# EAGLE board electron_v020 (EAGLE 7.2.0)
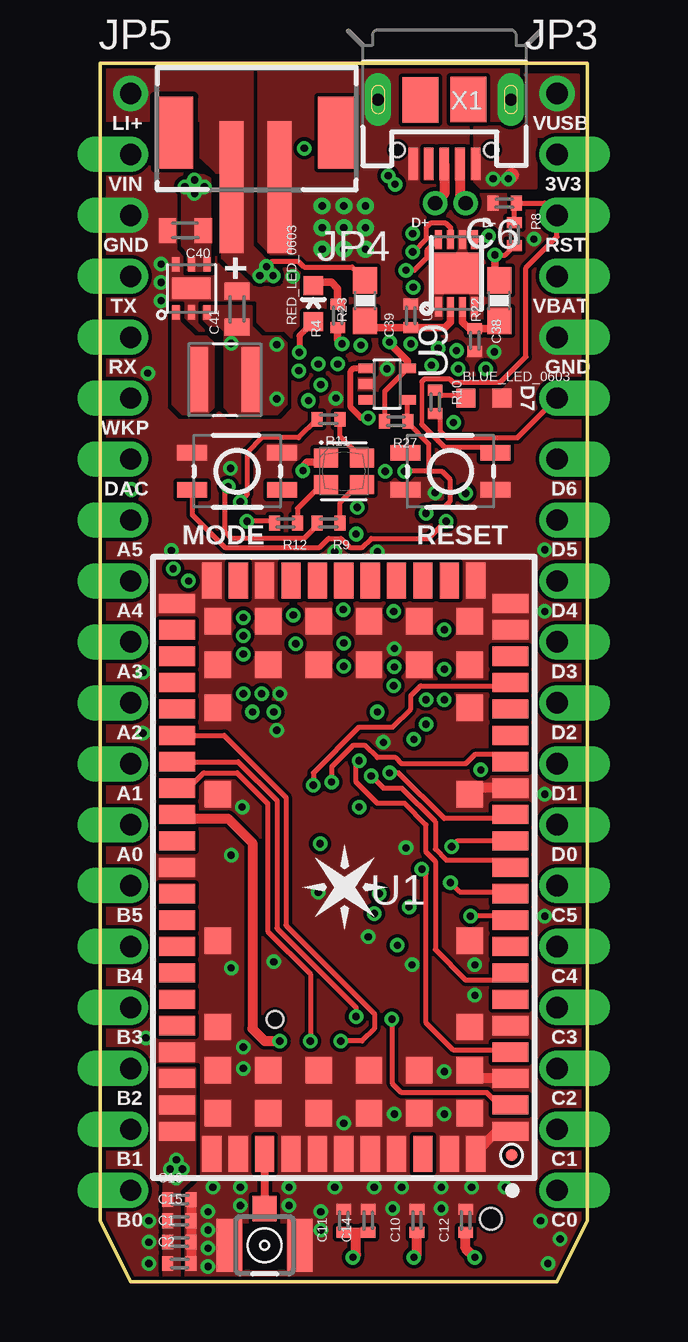
[diagram p4: board, top side]
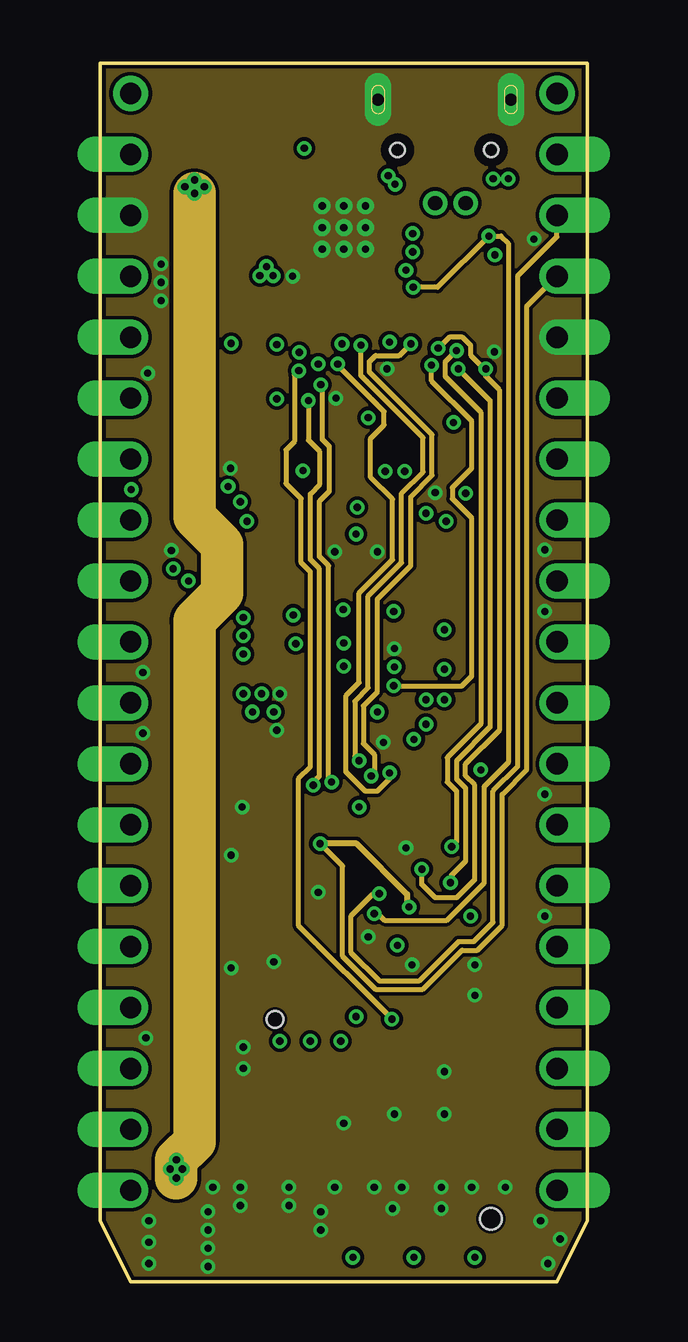
[diagram p5: board, inner layer $GND]
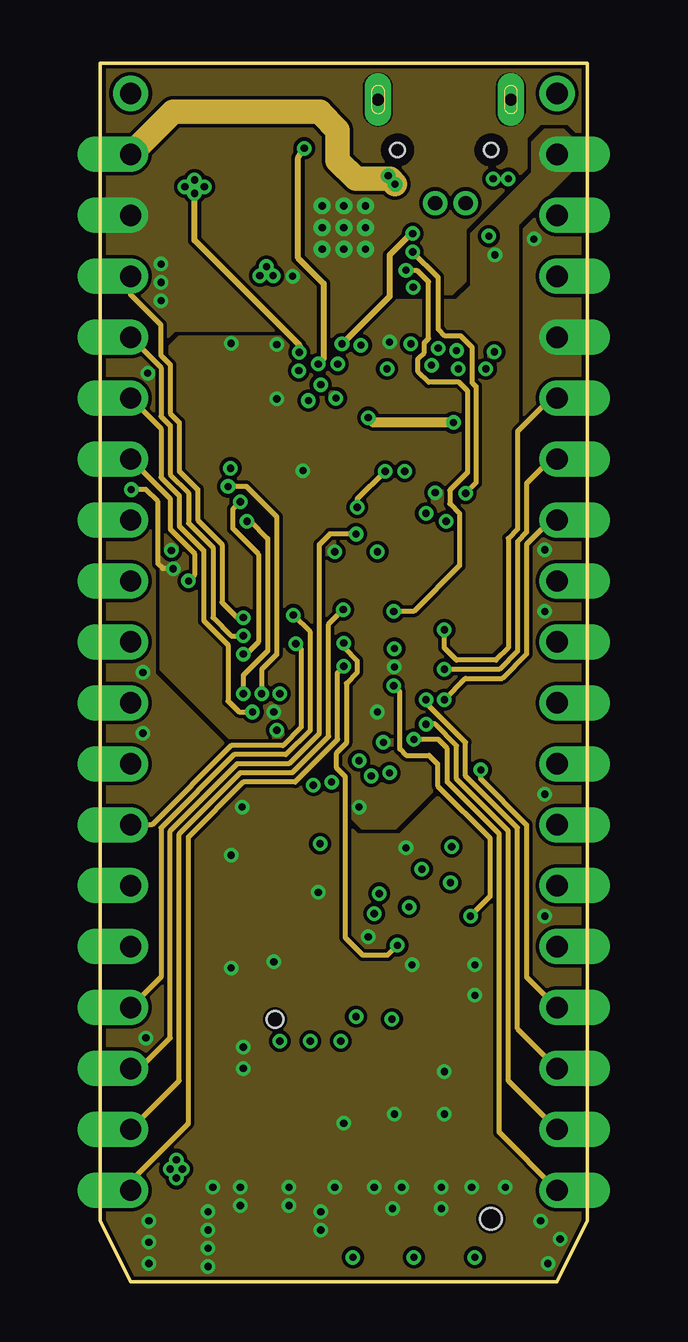
[diagram p6: board, inner layer $+3V3]
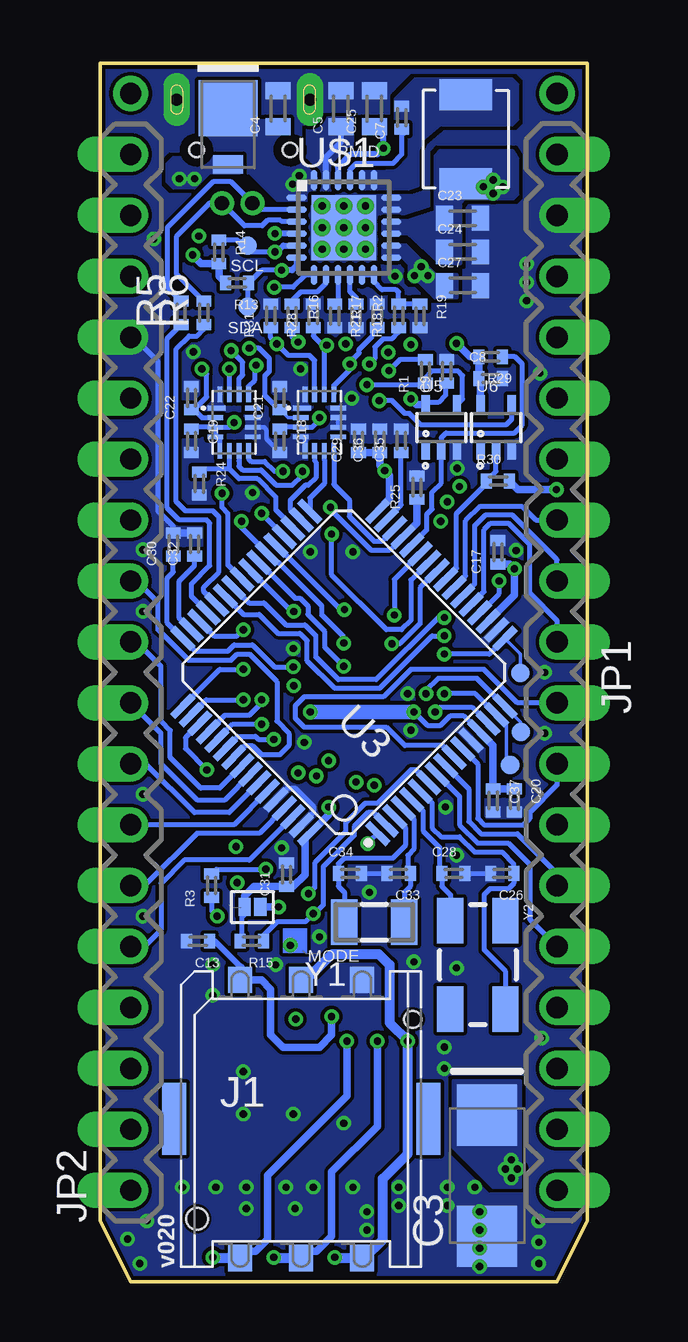
[diagram p7: board, bottom side, seen from below]

Size 20.32 x 50.8 mm. Coordinates in mm from the lower left corner, seen from the top.
Outline: 0,50.8 0,2.54 1.27,0 19.05,0 20.32,2.54 20.32,50.8 0,50.8
Copper layers (1+2*15+16): Top 0.018mm / dielectric 0.195mm / $GND 0.035mm / dielectric 1.1mm / $+3V3 0.035mm / dielectric 0.195mm / Bottom 0.018mm
Design rules "particle-4layer": minimum track width 6mil, minimum drill 0.3mm, track to track 6mil, track to pad 6mil, pad to pad 6mil, via to via 6mil, smd to smd 6mil, copper to edge 6mil, drill to drill 6mil, minimum pad ring 8mil, minimum via ring 6mil, stop-mask expansion 4mil, vias tented up to drill 20mil, thermal gap 8mil
Net classes: 2 RF: width 0.33 mm, clearance 0.191 mm; 3 BAT: clearance 0.203 mm

## Footprints (pad centres in the part's own frame; a part is rotated, then mirrored left to right if it is on the bottom)
LED-0603-NS = smd 0.8 x 0.8: A -0.75,0; C 0.75,0
C0402_B = smd 0.457 x 0.61: 1 -0.483,0; 2 0.483,0
C/6032-28R = smd 2.55 x 2.5: + 2.525,0; - -2.525,0
C0603_B = smd 0.711 x 1.041: 1 -0.749,0; 2 0.749,0
GCT-SIM8100 = smd 1 x 1.1: C1 2.54,-5.8; C2 0,-5.8; C3 -2.54,-5.8; C5 2.54,5.8; C6 0,5.8; C7 -2.54,5.8 | smd 1 x 3: NC@1 -5.3,0; NC@2 5.3,0 | hole 0.7: 4.65,4.15 | hole 0.9: -4.35,-4.15
IPEX-20279-001E = smd 1 x 1.05: 1 0,1.528 | smd 1.05 x 2.2: 2@1 -1.475,0; 2@2 1.475,0
JUMPER_SMD_NC = smd 0.508 x 0.762: 1 -0.33,0; 2 0.33,0
1X18-D-PADS = drill 0.889 pad 1.473 offset: 1 -21.59,0; 2 -19.05,0; 3 -16.51,0; 4 -13.97,0; 5 -11.43,0; 6 -8.89,0; 7 -6.35,0; 8 -3.81,0; 9 -1.27,0; 10 1.27,0; 11 3.81,0; 12 6.35,0; 13 8.89,0; 14 11.43,0; 15 13.97,0; 16 16.51,0; 17 19.05,0; 18 21.59,0
1X01_NO_SILK = drill 0.889 pad 1.473: 1 0,0
JST-2-SMD-VERT = smd 1 x 5.5: GND 1,-2; VCC -1,-2 | smd 1.6 x 3: P$1 -3.4,0.27; P$2 3.4,0.27
PLCC4-2MM-RGB = smd 1 x 0.8: BLUE -0.75,-0.55; CA 0.75,-0.55; GREEN -0.75,0.55; RED 0.75,0.55
R0402_B = smd 0.457 x 0.61: 1 -0.483,0; 2 0.483,0
0603-RES = smd 1.1 x 1: 1 -0.85,0; 2 0.85,0
LED-0603 = smd 0.8 x 0.8: A 0,-0.75; C 0,0.75
TACTILE_SWITCH_SMD = smd 1.25 x 0.65: 1 -1.875,0.775; 2 1.875,0.775; 3 -1.875,-0.775; 4 1.875,-0.775
U-BLOX-SARA-U2 = smd 1.5 x 0.8: 1 -6.95,11; 2 -6.95,9.9; 3 -6.95,8.8; 4 -6.95,7.7; 5 -6.95,6.6; 6 -6.95,5.5; 7 -6.95,4.4; 8 -6.95,3.3; 9 -6.95,2.2; 10 -6.95,1.1; 11 -6.95,0; 12 -6.95,-1.1; 13 -6.95,-2.2; 14 -6.95,-3.3; 15 -6.95,-4.4; 16 -6.95,-5.5; 17 -6.95,-6.6; 18 -6.95,-7.7; 19 -6.95,-8.8; 20 -6.95,-9.9; 21 -6.95,-11; 33 6.95,-11; 34 6.95,-9.9; 35 6.95,-8.8; 36 6.95,-7.7; 37 6.95,-6.6; 38 6.95,-5.5; 39 6.95,-4.4; 40 6.95,-3.3; 41 6.95,-2.2; 42 6.95,-1.1; 43 6.95,0; 44 6.95,1.1; 45 6.95,2.2; 46 6.95,3.3; 47 6.95,4.4; 48 6.95,5.5; 49 6.95,6.6; 50 6.95,7.7; 51 6.95,8.8; 52 6.95,9.9; 53 6.95,11 | smd 0.8 x 1.5: 22 -5.5,-11.95; 23 -4.4,-11.95; 24 -3.3,-11.95; 25 -2.2,-11.95; 26 -1.1,-11.95; 27 0,-11.95; 28 1.1,-11.95; 29 2.2,-11.95; 30 3.3,-11.95; 31 4.4,-11.95; 32 5.5,-11.95; 54 5.5,11.95; 55 4.4,11.95; 56 3.3,11.95; 57 2.2,11.95; 58 1.1,11.95; 59 0,11.95; 60 -1.1,11.95; 61 -2.2,11.95; 62 -3.3,11.95; 63 -4.4,11.95; 64 -5.5,11.95 | smd 1.1 x 1.1: 65 -5.25,10.25; 66 -3.15,10.25; 67 -1.05,10.25; 68 1.05,10.25; 69 3.15,10.25; 70 5.25,10.25; 71 -5.25,8.45; 72 -3.15,8.45; 73 -1.05,8.45; 74 1.05,8.45; 75 3.15,8.45; 76 5.25,8.45; 77 -5.25,6.65; 78 5.25,6.65; 79 -5.25,3.05; 80 5.25,3.05; 81 -5.25,-3.05; 82 5.25,-3.05; 83 -5.25,-6.65; 84 5.25,-6.65; 85 -5.25,-8.45; 86 -3.15,-8.45; 87 -1.05,-8.45; 88 1.05,-8.45; 89 3.15,-8.45; 90 5.25,-8.45; 91 -5.25,-10.25; 92 -3.15,-10.25; 93 -1.05,-10.25; 94 1.05,-10.25; 95 3.15,-10.25; 96 5.25,-10.25 | smd 0.5 x 0.5: FID_PIN1 -7,12
UFQFN-16 = smd 0.2 x 0.75: 1 -0.6,-0.73 | smd 0.2 x 0.65: 2 -0.2,-0.78; 3 0.2,-0.78; 4 0.6,-0.78; 9 0.6,0.78; 10 0.2,0.78; 11 -0.2,0.78; 12 -0.6,0.78 | smd 0.65 x 0.2: 5 1.18,-0.6; 6 1.18,-0.2; 7 1.18,0.2; 8 1.18,0.6; 13 -1.18,0.6; 14 -1.18,0.2; 15 -1.18,-0.2; 16 -1.18,-0.6
LQFP64 = smd 1.2 x 0.3: 1 -5.75,3.75; 2 -5.75,3.25; 3 -5.75,2.75; 4 -5.75,2.25; 5 -5.75,1.75; 6 -5.75,1.25; 7 -5.75,0.75; 8 -5.75,0.25; 9 -5.75,-0.25; 10 -5.75,-0.75; 11 -5.75,-1.25; 12 -5.75,-1.75; 13 -5.75,-2.25; 14 -5.75,-2.75; 15 -5.75,-3.25; 16 -5.75,-3.75; 33 5.75,-3.75; 34 5.75,-3.25; 35 5.75,-2.75; 36 5.75,-2.25; 37 5.75,-1.75; 38 5.75,-1.25; 39 5.75,-0.75; 40 5.75,-0.25; 41 5.75,0.25; 42 5.75,0.75; 43 5.75,1.25; 44 5.75,1.75; 45 5.75,2.25; 46 5.75,2.75; 47 5.75,3.25; 48 5.75,3.75 | smd 0.3 x 1.2: 17 -3.75,-5.75; 18 -3.25,-5.75; 19 -2.75,-5.75; 20 -2.25,-5.75; 21 -1.75,-5.75; 22 -1.25,-5.75; 23 -0.75,-5.75; 24 -0.25,-5.75; 25 0.25,-5.75; 26 0.75,-5.75; 27 1.25,-5.75; 28 1.75,-5.75; 29 2.25,-5.75; 30 2.75,-5.75; 31 3.25,-5.75; 32 3.75,-5.75; 49 3.75,5.75; 50 3.25,5.75; 51 2.75,5.75; 52 2.25,5.75; 53 1.75,5.75; 54 1.25,5.75; 55 0.75,5.75; 56 0.25,5.75; 57 -0.25,5.75; 58 -0.75,5.75; 59 -1.25,5.75; 60 -1.75,5.75; 61 -2.25,5.75; 62 -2.75,5.75; 63 -3.25,5.75; 64 -3.75,5.75
TDFN-8 = smd 0.8 x 0.3: 1 -1.4,0.75; 2 -1.4,0.25; 3 -1.4,-0.25; 4 -1.4,-0.75; 5 1.4,-0.75; 6 1.4,-0.25; 7 1.4,0.25; 8 1.4,0.75 | smd 1.73 x 1.88: EP 0,0
SC-70-5 = smd 0.35 x 0.8: 1 -0.65,-0.95; 2 0,-0.95; 3 0.65,-0.95; 4 0.65,0.95; 5 -0.65,0.95
SC70-5 = smd 0.4 x 0.7: 1 -0.65,-0.85; 2 0,-0.85; 3 0.65,-0.85; 4 0.65,0.85; 5 -0.65,0.85
QFN24 = smd 0.85 x 0.28: 1 -1.975,1.25; 2 -1.975,0.75; 3 -1.975,0.25; 4 -1.975,-0.25; 5 -1.975,-0.75; 6 -1.975,-1.25; 13 1.975,-1.25; 14 1.975,-0.75; 15 1.975,-0.25; 16 1.975,0.25; 17 1.975,0.75; 18 1.975,1.25 | smd 0.28 x 0.85: 7 -1.25,-1.975; 8 -0.75,-1.975; 9 -0.25,-1.975; 10 0.25,-1.975; 11 0.75,-1.975; 12 1.25,-1.975; 19 1.25,1.975; 20 0.75,1.975; 21 0.25,1.975; 22 -0.25,1.975; 23 -0.75,1.975; 24 -1.25,1.975 | smd 2.7 x 2.7: PAD 0,0 | drill 0.3 pad 0.406: PAD@1 -0.9,0.9; PAD@2 0,0.9; PAD@3 0.9,0.9; PAD@4 -0.9,0; PAD@5 0,0; PAD@6 0.9,0; PAD@7 -0.9,-0.9; PAD@8 0,-0.9; PAD@9 0.9,-0.9
DIODE-DO-220AA_NT(SMP) = smd 0.762 x 1.27: ANODE 2.349,0 | smd 2.337 x 2.464: CATHODE 0,0
4020TYPE_NT = smd 1.295 x 2.184: P$1 -1.854,0; P$2 1.854,0
S-PWSON-N6 = smd 0.3 x 0.6: P$1 -0.65,-1; P$2 0,-1; P$3 0.65,-1; P$4 0.65,1; P$5 0,1; P$6 -0.65,1 | smd 1.6 x 0.9: TP 0,0
INDUCTOR-NR3015 = smd 0.8 x 2.7: 1 -1.1,0; 2 1.1,0
M02_0.05_HEADER = drill 0.6 pad 1: P$1 -0.635,0; P$2 0.635,0
TP30_BOT = smd 0.762 x 0.762 bottom: P$1 0,0
USB-MICROB-SLOT-HOLE = smd 0.4 x 1.35: D+ 0,2.675; D- -0.65,2.675; GND 1.3,2.675; ID 0.65,2.675; VBUS -1.3,2.675 | drill 0.5 pad 1.1 long: MT1 -2.775,0; MT2 2.775,0 | smd 1.5 x 1.9: P$1 -1,0; P$2 1,0.01 | hole 0.6: -1.95,2.1; 1.95,2.1
FC135 = smd 1.1 x 1.9: X1 -1.25,0; X2 1.25,0
CRYSTAL-SMD-5X3 = smd 1.9 x 1.1: 1 -1.85,-1.15; 2 1.85,-1.15; 3 1.85,1.15; 4 -1.85,1.15

## Placement (x,y rotation side)
BLUE_LED_0603  [LED-0603-NS]  16,36.83 0 top
C1  10nF  [C0402_B]  3.3,1.65 0 top
C2  0.1uF  [C0402_B]  3.3,0.76 0 top
C3  220uF  [C/6032-28R]  4.19,4.42 90 bottom
C4  1uF  [C0603_B]  12.9,48.9 90 bottom
C5  20uF  [C0603_B]  10.29,48.9 90 bottom
C6  0.1uF  [C0402_B]  16.87,44.96 180 top
C7  47nF  [C0402_B]  7.75,48.51 90 bottom
C8  0.1uF  [C0402_B]  4.04,37.64 0 bottom
C9  0.1uF  [C0402_B]  5.87,37.95 90 bottom
C10  47pF  [C0402_B]  13.21,2.54 90 top
C11  47pF  [C0402_B]  10.16,2.54 90 top
C12  47pF  [C0402_B]  15.24,2.54 90 top
C13  47pF  [C0402_B]  16.23,14.2 180 bottom
C14  0.1uF  [C0402_B]  11.18,2.54 90 top
C15  68pF  [C0402_B]  3.3,2.54 0 top
C16  15pF  [C0402_B]  3.3,3.43 0 top
C17  0.1uF  [C0402_B]  3.73,30.4 90 bottom
C18  0.1uF  [C0402_B]  12.83,35.05 270 bottom
C19  0.1uF  [C0402_B]  16.51,35.05 270 bottom
C20  0.1uF  [C0402_B]  3.05,20.07 270 bottom
C21  0.1uF  [C0402_B]  12.83,36.83 90 bottom
C22  0.1uF  [C0402_B]  16.51,36.83 90 bottom
C23  10uF  [C0603_B]  5.21,44.32 0 bottom
C24  10uF  [C0603_B]  5.21,42.93 0 bottom
C25  4.7uF  [C0603_B]  8.89,48.9 90 bottom
C26  20pF  [C0402_B]  3.56,17.02 180 bottom
C27  10uF  [C0603_B]  5.21,41.53 0 bottom
C28  20pF  [C0402_B]  5.59,17.02 0 bottom
C29  0.1uF  [C0402_B]  9.55,35.05 90 bottom
C30  0.1uF  [C0402_B]  17.27,30.73 90 bottom
C31  0.1uF  [C0402_B]  12.55,16.97 90 bottom
C32  2.2uF  [C0402_B]  16.38,30.73 90 bottom
C33  12pF  [C0402_B]  7.87,17.02 180 bottom
C34  12pF  [C0402_B]  9.91,17.02 0 bottom
C35  2.2uF  [C0402_B]  7.77,35.05 90 bottom
C36  4.7uF  [C0402_B]  8.66,35.05 90 bottom
C37  1uF  [C0402_B]  3.94,20.07 270 bottom
C38  10nF  [C0402_B]  15.62,39.24 270 top
C39  1uF  [C0402_B]  12.95,40.26 90 top
C40  10uF  [C0603_B]  3.55,43.82 180 top
C41  10uF  [C0603_B]  5.71,40.53 90 top
J1  SIM-NANO-4FF  [GCT-SIM8100]  11.94,6.78 0 bottom
J2  IPEX-20279-001E  [IPEX-20279-001E]  6.86,1.52 0 top
J3  JUMPER_NC_SMD  [JUMPER_SMD_NC]  13.97,15.62 0 bottom
JP1  M18DPAD  [1X18-D-PADS]  1.27,25.4 270 bottom
JP2  M18DPAD  [1X18-D-PADS]  19.05,25.4 90 bottom
JP3  [1X01_NO_SILK]  19.05,49.53 0 top
JP4  [JST-2-SMD-VERT]  6.48,47.62 0 top
JP5  [1X01_NO_SILK]  1.27,49.53 0 top
LED2  RGB-LED-CLMVB-FKARGB  [PLCC4-2MM-RGB]  10.16,33.78 180 top
R1  100k  [R0402_B]  6.76,37.95 90 bottom
R2  333R  [R0402_B]  9.65,40.26 270 bottom
R3  10K  [R0402_B]  15.67,16.51 90 bottom
R4  2.2K  [R0402_B]  9.91,40.26 90 top
R5  22  [R0402_B]  16.94,40.39 90 bottom
R6  22  [R0402_B]  16,40.39 90 bottom
R8  10K  [R0402_B]  17.27,43.66 270 top
R9  1K  [R0402_B]  9.53,31.62 180 top
R10  1K  [R0402_B]  13.97,36.68 270 top
R11  1K  [R0402_B]  9.53,35.94 180 top
R12  1K  [R0402_B]  7.75,31.62 180 top
R13  4K7  [R0402_B]  14.61,41.63 180 bottom
R14  4K7  [R0402_B]  15.37,42.93 270 bottom
R15  10K  [R0402_B]  14,14.2 180 bottom
R16  10K  [R0402_B]  12.32,40.26 270 bottom
R17  10K  [R0402_B]  10.54,40.26 270 bottom
R18  5.52K  [R0402_B]  7.87,40.26 90 bottom
R19  10K  [R0402_B]  6.99,40.26 270 bottom
R21  10K  [R0402_B]  8.76,40.26 90 bottom
R22  150  [0603-RES]  16.64,40.89 90 top
R23  1K  [0603-RES]  11.05,40.89 90 top
R24  10K  [R0402_B]  16.18,33.27 270 bottom
R25  10K  [R0402_B]  7.11,33.1 90 bottom
R27  10K  [R0402_B]  12.34,35.86 180 top
R28  10K  [R0402_B]  11.43,40.26 90 bottom
R29  10K  [R0402_B]  4.04,38.56 180 bottom
R30  10K  [R0402_B]  3.73,33.38 0 bottom
R31  10K  [R0402_B]  13.21,40.26 90 bottom
RED_LED_0603  [LED-0603]  8.89,40.77 0 top
RESET  KMR211GLFS  [TACTILE_SWITCH_SMD]  14.61,33.78 0 top
SETUP  KMR211GLFS  [TACTILE_SWITCH_SMD]  5.71,33.78 0 top
U1  U-BLOX-SARA-U260  [U-BLOX-SARA-U2]  10.16,17.27 180 top
U2  SN74AVC4T245  [UFQFN-16]  14.73,35.81 270 bottom
U3  STM32F205RG  [LQFP64]  10.16,25.4 135 bottom
U4  MAX1704X  [TDFN-8]  14.86,42.04 90 top
U5  SN74LVC1G07  [SC-70-5]  6.1,35.61 0 bottom
U6  SN74LVC1G07  [SC-70-5]  3.81,35.61 0 bottom
U8  SN74AVC4T245  [UFQFN-16]  11.18,35.81 270 bottom
U9  TPS22942DCKRSMALL  [SC70-5]  11.96,37.41 270 top
U$1  BQ24298 / BQ24195L  [QFN24]  10.16,43.94 0 bottom
U$2  SPARK_LOGO2  [SPARK_LOGO2]  16.33,0.25 0 top
U$3  DIODE_NT  [DIODE-DO-220AA_NT(SMP)]  14.99,48.92 270 bottom
U$4  2.2uH  [4020TYPE_NT]  5.08,47.62 270 bottom
U$5  TPS62291DRV  [S-PWSON-N6]  3.81,41.4 0 top
U$6  2.2uH - NR3015T2R2M  [INDUCTOR-NR3015]  5.2,37.6 0 top
U$7  M02_0.05_HEADER  [M02_0.05_HEADER]  14.61,44.96 0 top
U$8  TP0  [TP30_BOT]  14.17,40.64 0 top
U$9  TP0  [TP30_BOT]  14.17,43.18 0 top
U$11  TP0  [TP30_BOT]  3.23,21.54 0 top
U$12  TP0  [TP30_BOT]  2.77,22.91 0 top
U$13  TP0  [TP30_BOT]  2.79,25.37 0 top
X1  USB-MICROB  [USB-MICROB-SLOT-HOLE]  14.35,49.28 180 top
Y1  32Khz  [FC135]  8.89,14.99 0 bottom
Y2  26Mhz  [CRYSTAL-SMD-5X3]  4.57,13.21 270 bottom

## Tracks (layer width: path | path; a pad name or v marks a point on that pad's centre or on a via)
!BATT_INT_PC13  (via drill 0.3)
  Top 0.203: U4.5 16.06,43.44 v16.2,43.59
  $GND 0.203: v11.43,15.34 11.58,15.34 11.86,15.06 14.45,15.06 16,16.61 16,20.62 17.02,21.64 17.02,43.28 16.71,43.59 v16.2,43.59 14.07,41.45 v13.06,41.45
  Bottom 0.203: U$1.7 11.75,41.97 12.27,41.45 v13.06,41.45 | U3.2 8.91,19.56 9.14,19.56 9.73,18.97 9.73,18.59 11.02,17.3 11.02,15.7 11.38,15.34 v11.43,15.34 11.76,15.01 12.93,15.01 13.51,14.43 R15.1
!CE
  Bottom 0.203: U$1.9 10.41,40.87 R17.1
!RST  (via drill 0.3)
  Top 0.178: 13.41,37.52 13.41,35.74
  Top 0.203: R8.1 17.27,44.88 C6.1 18.54,44.96 JP2.17 19.05,43.56 17.75,42.27 17.75,38.56 16.69,37.49 14.71,37.49 14.55,37.64 13.54,37.64 13.41,37.52 | RESET.2 16.26,34.77 14.38,34.77 13.41,35.74
  $GND 0.203: JP2.17 19.05,43.56 17.4,41.91 17.4,21.46 16.38,20.45 16.38,14.99 15.57,14.17 14.94,14.17 13.28,12.52 11.66,12.52 10.46,13.72 10.46,15.24 11.4,16.18 v11.63,16.18
  Bottom 0.203: U3.7 7.16,21.34 7.37,21.34 8.76,19.94 9.27,19.94 10.08,19.13 10.08,18.75 11.38,17.45 11.38,16.43 v11.63,16.18
!SETUP  (via drill 0.3)
  Top 0.203: SETUP.3 3.84,31.97 5.21,30.61 9.14,30.61 9.53,30.99 10.03,30.99 10.41,30.61 10.92,30.61 11.3,30.99 13.72,30.99 v14.43,31.7
  $+3V3 0.203: v10.16,26.62 10.16,26.44 10.72,25.88 10.72,25.4 10.26,24.94 10.26,22.45 9.86,22.05 9.86,21.41 10.21,21.06 10.21,14.35 10.95,13.61 11.99,13.61 v12.39,14.02
  Bottom 0.203: v10.16,26.62 10.16,26.87 11.07,27.79 11.07,28.17 12.88,29.97 12.96,29.97 U3.38 14.43,31.43 v14.43,31.7
+3V3  (via drill 0.3)
  Top 0.203: v16.46,42.8 16.89,42.8 R8.2 | U9.5 11.86,37.11 R27.2
  Top 0.305: v8.46,33.81 8.46,33.98 8.64,34.16 9.24,34.16 LED2.CA | v16.46,42.8 16.46,41.92 R22.2 | v12.06,39.17 12.06,39.12 12.81,38.37 U9.5
  $+3V3 0.203: v3.05,29.72 2.62,29.72 2.41,29.92 2.41,32.51 1.91,33.02 v1.29,33.02
  Bottom 0.203: C30.1 17.27,29.59 17.53,29.34 17.53,27.46 U3.48 16.35,26.29 14.99,26.29 14.73,26.54 13.97,26.54 13.06,25.63 v12.27,25.63 | v7.24,23.75 6.68,23.19 6.12,23.19 5.71,23.6 5.17,23.6 U3.13 | U3.64 11.57,18.65 11.73,18.49 | C9.1 5.92,37.47 5.92,36.96 6.22,36.65 6.66,36.65 U5.5 | R15.2 14.4,14.28 14.4,15.21 14.3,15.32 J3.1
  Bottom 0.254: U3.32 8.75,32.15 | 8.48,33.81 v8.46,33.81 | R16.2 12.32,39.42 v12.06,39.17
  Bottom 0.305: U3.13 3.94,22.36 C37.1 C20.1 | U3.19 3.05,28.62 v3.05,29.72 3.25,29.92 C17.1 | U3.64 10.79,19.46 v10.79,19.79 | 8.75,32.15 8.26,32.64 8.26,33.6 v8.46,33.81 8.66,34.01 C36.1 C29.1 | U6.5 4.46,37.58 C8.1 R29.2 4.9,38.56 v5.46,39.12 | U5.5 7.12,36.56 v7.37,36.8 | v16.46,42.8 16.1,42.44 R14.2 15.37,41.91 R13.2 | 11.73,18.49 11.79,18.44 11.79,16.97 12.27,16.48 C31.1 13.89,16.48 14.3,16.08 J3.1 | v1.29,33.02 2.9,33.02 R30.2
  Bottom 0.61: v7.24,23.75 v11.56,23.75
  other vias: 7.37,39.07
  pour $+3V3 (no thermals): 2.92,38.99 3.3,39.37 10.41,39.37 11.94,40.89 14.86,40.89 15.49,41.53 15.49,43.69 18.03,46.23 18.03,47.5 18.54,48.01 19.3,48.01 19.68,47.62 19.68,46.35 17.4,44.07 17.4,35.43 17.4,27.3 14.61,24.51 14.61,21.21 12.32,18.92 10.92,18.92 7.49,22.35 5.71,22.35 2.54,25.53 2.54,30.48 2.92,30.86
  pour Top (rank 2, no thermals): 4.32,40.64 6.3,40.64 6.3,39.8 6.73,39.37 7.49,39.37 7.75,39.12 7.75,36.58 7.37,36.2 5.46,36.2 5.21,36.45 5.21,39.62 4.95,39.88 4.57,39.88 4.32,40.13
+3V8  (via drill 0.3)
  Top 0.254: RED_LED_0603.A 8.31,39.43 v8.31,38.73
  Top 0.406: RED_LED_0603.A 9.04,39.87
  $GND 1.778: v3.17,4.32 v3.17,5.08 3.94,5.84 3.94,27.56 5.08,28.7 5.08,30.73 3.94,31.88 v3.94,45.36
  $+3V3 0.254: v3.94,45.36 3.94,43.41 8.31,39.04 v8.31,38.73
  other vias: 3.94,45.92 3.53,45.64 4.34,45.64 3.43,4.7 2.92,4.7
  pour Bottom (no thermals): 2.79,8.38 5.59,8.38 5.59,5.59 3.94,3.94 2.79,3.94
  pour Top (no thermals): 2.41,8.89 3.94,8.89 3.94,4.45 3.3,3.81 3.3,0.25 2.67,0.25 2.67,4.19 2.41,4.45
  pour Bottom (no thermals): 8.53,44.22 8.53,43.69 7.49,43.69 6.12,42.44 5.31,42.44 5.31,44.96 5.13,45.14 3.1,45.14 2.92,45.31 2.92,46.81 3.12,47.14 6.15,47.14 6.35,46.94 6.35,44.6 7.49,44.22
  pour Top (no thermals): 4.57,42.16 3.68,42.16 3.68,42.93 3.43,43.18 3.43,45.72 3.81,46.1 4.32,46.1 4.57,45.97
A0  (via drill 0.3)
  $+3V3 0.203: v8.15,26.59 8.38,26.36 8.38,23.11 7.62,22.35 5.46,22.35 2.16,19.05 JP1.12
  Bottom 0.203: U3.25 6.99,28.93 6.99,27.43 7.82,26.59 v8.15,26.59
A1
  Bottom 0.203: U3.11 4.57,21.58 4.57,19.3 4.32,19.05 2.67,19.05 2.41,19.3 2.41,19.56 1.27,20.7 JP1.11
A2
  Bottom 0.203: JP1.10 2.92,24.13 4.32,25.53 7.37,25.53 8.51,24.38 11.81,24.38 12.19,24 12.19,23.5 11.81,23.11 8.38,23.11 7.62,22.35 6.05,22.35 U3.10
A3
  Bottom 0.203: U3.21 4.32,28.77 4.32,31.34 4.06,31.6 3.28,31.6 2.41,30.73 2.41,28.7 1.27,27.56 JP1.9
A4
  Bottom 0.203: U3.22 4.7,29.09 4.7,31.52 4.27,31.95 3.12,31.95 1.27,30.1 JP1.8
A5
  Bottom 0.203: U3.23 5.08,29.42 5.08,31.73 4.5,32.31 2.72,32.31 2.16,31.75 JP1.7
ANT
  Top 0.33: U1.56 J2.1
  Top 0.61: J2.1
B0  (via drill 0.3)
  $+3V3 0.203: JP1.18 1.27,4.19 3.68,6.6 3.68,18.54 5.97,20.83 8.13,20.83 9.91,22.61 9.91,25.4 v10.16,25.65
  Bottom 0.203: U3.39 12.2,28.5 11.99,28.5 11.66,28.17 11.66,27.81 10.95,27.1 10.95,26.44 v10.16,25.65
B1  (via drill 0.3)
  $+3V3 0.203: JP1.17 3.3,8.38 3.3,18.67 5.84,21.21 8,21.21 9.53,22.73 9.53,27.41 v10.13,28.02
  Bottom 0.203: U3.37 10.3,28.02 v10.13,28.02
B2  (via drill 0.3)
  $+3V3 0.203: JP1.16 1.65,8.89 2.92,10.16 2.92,18.8 5.71,21.59 7.87,21.59 9.14,22.86 9.14,30.73 9.58,31.17 v10.67,31.17
  Bottom 0.203: U3.26 7.37,29.25 7.37,27.56 7.75,27.18 8.38,27.18 10.67,29.46 v10.67,31.17
B3  (via drill 0.3)
  $+3V3 0.203: JP1.15 2.54,12.7 2.54,18.92 5.59,21.97 7.75,21.97 8.76,22.99 8.76,27.08 v8.05,27.79
  Bottom 0.203: U3.27 8.05,29.28 v8.05,27.79
B4
  Bottom 0.203: U3.8 5.33,20.22 5.33,19.05 4.57,18.29 3.3,18.29 2.41,17.4 2.41,15.11 JP1.14
B5
  Bottom 0.203: JP1.13 1.27,17.02 2.92,18.67 4.45,18.67 4.95,19.18 4.95,20.55 U3.9
BAT  (via drill 0.3)
  Top 0.203: R23.2 10.5,42.29 8.51,42.29 8.28,42.52 7.14,42.52 v6.93,42.32
  other vias: 6.65,41.94 7.21,41.94
  pour Bottom (rank 3, no thermals): 8.53,43.21 8.53,42.7 7.72,42.7 7.42,42.39 7.42,41.78 7.32,41.68 7.04,41.68 6.38,41.02 5.44,41.02 5.44,41.99 6.35,41.99 7.57,43.21
  pour Top (rank 3, no thermals): 5.08,48.39 6.35,48.39 6.35,43.18 7.42,42.11 7.42,42.01 7.42,41.78 7.34,41.71 6.55,41.71 5.97,42.29 5.46,42.29 5.08,42.67
  pour Top (no thermals): 0.25,48.39 4.19,48.39 4.19,46.86 4.83,46.23 6.35,46.23 6.35,50.55 0.25,50.55
BTST
  Bottom 0.203: C7.1 7.62,47.9 7.75,47.78 7.75,46.99 8.13,46.61 9.65,46.61 9.91,46.35 U$1.21
C0  (via drill 0.3)
  $+3V3 0.203: v13.08,22.61 14.1,22.61 14.48,22.23 14.48,20.83 16.64,18.67 16.64,6.22 JP2.1
  Bottom 0.203: U3.54 14.6,22.73 13.84,22.73 13.72,22.61 v13.08,22.61
C1  (via drill 0.3)
  $+3V3 0.203: v13.59,23.24 13.97,23.24 14.86,22.35 14.86,20.95 17.02,18.8 17.02,8.38 JP2.2
  Bottom 0.203: U3.53 14.79,23.24 v13.59,23.24
C2  (via drill 0.3)
  $+3V3 0.203: v13.59,24.26 13.59,24.13 15.24,22.48 15.24,21.08 17.4,18.92 17.4,10.54 JP2.3
  Bottom 0.203: U3.52 15.12,23.62 14.1,23.62 13.59,24.13 v13.59,24.26
C3  (via drill 0.3)
  $+3V3 0.203: v15.88,21.34 15.88,20.95 17.78,19.05 17.78,12.7 JP2.4
  Bottom 0.203: U3.51 16.76,22.68 16.76,22.23 v15.88,21.34
C4
  Bottom 0.203: 18.41,13.97 18.47,13.97 | 18.47,13.97 JP2.5 | U3.62 14.09,17.58 16.82,17.58 17.78,16.61 17.78,14.66 18.47,13.97
C5
  Bottom 0.203: JP2.6 18.41,16.51 18.41,16.56 16.28,18.69 13.68,18.69 U3.61
CTS_UB  (via drill 0.3)
  Top 0.203: v11.3,21.08 11.81,20.57 12.57,20.57 13.97,19.18 13.97,18.03 14.43,17.58 16.8,17.58 U1.11
  $GND 0.203: v11.3,21.08 11.43,21.21 11.43,21.97 10.97,22.43 10.97,24 11.56,24.59 11.56,28.45 12.95,29.84 12.95,32.72 13.84,33.6 13.84,35.31 11.23,37.92 11.23,38.35 11.48,38.61 12.47,38.61 v12.95,39.09
  Bottom 0.203: U8.15 11.38,38.4 11.58,38.61 12.47,38.61 v12.95,39.09 13.21,39.34 R31.1 13.21,39.75
CTS_UC
  Bottom 0.203: U8.6 11.38,34.21 11.33,34.16 11.33,33.5 11.63,33.2 11.76,33.2 12.39,32.56 12.39,32.21 11.95,31.76 U3.34
D0
  Bottom 0.203: U3.59 14.74,19.05 JP2.7
D1
  Bottom 0.203: U3.58 14.94,19.56 16.38,19.56 18.41,21.59 JP2.8
D2
  Bottom 0.203: U3.57 15.14,20.07 16.26,20.07 17.78,21.59 17.78,22.86 JP2.9
D3
  Bottom 0.203: U3.56 15.34,20.57 16.13,20.57 17.4,21.84 17.4,22.99 17.78,23.37 17.78,25.65 18.8,26.67 JP2.10
D4
  Bottom 0.203: U3.55 14.27,22.35 13.97,22.35 13.59,21.97 12.83,21.97 12.45,22.35 12.45,22.86 12.95,23.37 12.95,25.02 14.1,26.16 14.61,26.16 14.86,25.91 16.64,25.91 17.91,27.18 17.91,28.32 18.8,29.21 JP2.11
D5  (via drill 0.3)
  $+3V3 0.203: v14.35,24.26 15.24,25.15 16.76,25.15 17.78,26.16 17.78,30.73 18.8,31.75 JP2.12
  Bottom 0.203: U3.50 15.9,24.26 v14.35,24.26
D6  (via drill 0.3)
  $+3V3 0.203: v14.35,25.53 16.64,25.53 17.4,26.29 17.4,30.86 17.78,31.24 17.78,33.27 18.8,34.29 JP2.13
  Bottom 0.203: U3.49 15.34,25.53 v14.35,25.53
D7  (via drill 0.3)
  Top 0.203: JP2.14 17.4,35.18 14.48,35.18 14.17,35.48 14.17,36.07 14.05,36.2 R10.2
  $+3V3 0.203: v14.35,27.18 14.35,26.42 14.86,25.91 16.51,25.91 17.02,26.42 17.02,30.99 17.4,31.37 17.4,35.43 18.8,36.83 JP2.14
  Bottom 0.203: U3.46 15.57,26.92 14.61,26.92 v14.35,27.18
DAC  (via drill 0.3)
  $+3V3 0.203: JP1.6 2.92,32.64 2.92,31.37 3.94,30.35 3.94,29.46 v3.68,29.21
  Bottom 0.203: U3.20 3.68,28.7 v3.68,29.21
DTR_UB  (via drill 0.3)
  Top 0.203: U1.9 16.94,15.24 v15.44,15.24
  $GND 0.203: v12.24,24.84 15.09,24.84 15.49,25.25 15.49,31.83 14.68,32.64 14.68,33.1 15.49,33.91 15.49,35.87 13.82,37.54 v13.82,38.2
  $+3V3 0.203: v15.44,15.24 16.26,16.05 16.26,18.49 14.07,20.68 14.07,21.59 13.72,21.95 12.75,21.95 12.5,22.2 12.5,24.59 v12.24,24.84
  Bottom 0.203: U2.13 14.13,37.33 13.87,37.59 13.87,38.15 v13.82,38.2 | R3.1 15.67,15.47 v15.44,15.24
DTR_UC  (via drill 0.3)
  Top 0.203: 13.74,33.78 v12.7,33.78 | v13.59,32.03 13.87,32.31 14.38,32.31 14.58,32.51 14.58,33.45 14.25,33.78 13.74,33.78 | 13.74,33.78 13.69,33.83 13.69,34.92 12.83,35.79 R27.1 12.81,35.88 U9.4
  Bottom 0.203: U3.36 13.59,32.01 v13.59,32.03 | U2.8 14.12,34.29 14.02,34.19 13.46,34.19 13.06,33.78 v12.7,33.78
GND  (via drill 0.3)
  Top 0.254: 14.99,24.26 15.32,23.92 U1.83
  Top 0.406: C16.2 C15.2 C1.2 C2.2 | U1.64 15.66,5.37 16.51,6.22 17.06,6.22 U1.1 | U1.3 15.76,8.47 U1.71 | U1.14 15.66,20.57 U1.81
  Bottom 0.178: U2.10 13.49,35.61 13.39,35.51 13.39,35.13 C18.2
  Bottom 0.203: C28.2 C26.2 | C34.2 C33.2 | U3.60 12.51,20.57 12.19,20.57 11.43,19.81 11.43,19.56 11.93,19.06 U3.63 | U8.11 U8.10 | C30.2 17.27,31.5 17.91,32.13 17.91,38.35 18.92,39.37 | U8.5 11.78,35.21 U8.4
  Bottom 0.305: C32.2 C30.2
  other vias: 2.97,30.48 1.78,22.86 9.09,16.23 5.46,13.08 7.24,13.34 11.18,14.38 13.97,32.89 16.43,38.76 9.83,36.83 2.03,2.54 2.03,0.76 4.7,3.94 14.22,3.94 7.87,3.94 9.78,3.94 5.84,3.94 12.57,3.94 11.43,3.94 16.89,3.94 18.36,2.54 18.67,0.76 15.49,3.94 1.91,10.16 5.97,8.89 12.27,6.99 15.62,11.94 14.35,8.76 5.97,9.78 5.46,17.78 5.92,19.79 7.37,22.99 12.27,26.39 18.54,27.94 18.54,20.32 18.54,15.24 14.35,6.99 10.16,6.6 11.81,22.48 11.96,38.05 7.49,24.51 5.44,33.91 1.78,25.4 13,13.21 15.62,13.21 19.18,1.78 2.03,1.65 2.54,40.89 8.03,41.91 12.75,18.08 9.78,30.43 11.56,30.43 2.54,41.66 18.08,43.46 9.19,2.16 5.84,3.17 7.87,3.17 9.19,2.92 4.5,2.16 4.5,2.92 4.5,1.4 4.5,0.64 12.19,3.05 14.22,3.05 2.54,42.42 1.98,37.87 18.54,30.51
  pour $+3V3 (rank 4, no thermals): 0,50.8 20.32,50.8 20.32,2.54 19.05,0 1.27,0 0,2.54
  pour Top (rank 4, no thermals): 0,50.8 20.32,50.8 20.32,2.54 19.05,0 1.27,0 0,2.54
  pour Bottom (rank 4, no thermals): 0,50.8 20.32,50.8 20.32,2.54 19.05,0 1.27,0 0,2.54
  pour $GND (rank 4, no thermals): 0,50.8 20.32,50.8 20.32,2.54 19.05,0 1.27,0 0,2.54
ILIM
  Bottom 0.203: R2.1 9.65,41.02 9.91,41.27 U$1.10
  Bottom 0.254: U$1.10
LED1
  Top 0.203: 15.24,36.93 14.2,36.93 R10.1
  Top 0.305: 15.24,36.93 15.28,36.93
  Top 0.406: BLUE_LED_0603.A 15.24,36.93
N$4
  cutout $GND: 11.71,47.18 arc-90 12.4,47.87 12.41,47.87 arc-91 13.09,47.18 arc-88 12.4,46.49 arc-92
N$6
  Top 0.305: RED_LED_0603.C 9.03,41.66 9.65,41.66 9.91,41.4 R4.2
N$7
  Bottom 0.203: U$1.8 10.91,41.62 11.28,41.25 11.96,41.25 12.32,40.89 R16.1
N$10
  cutout Top: 5.97,2.41 7.75,2.41 7.75,0.51 5.97,0.51
N$11
  Top 0.305: R23.1 11.32,39.78 C39.1 14.38,39.78 14.61,40.01 U4.2
N$12
  Top 0.305: U4.3 15.11,40.01 15.37,39.75 15.6,39.75 C38.1 16.32,39.73 R22.1
N$15
  Bottom 0.203: U3.31 7.77,32.38 C35.1
N$16
  Bottom 0.203: U3.47 17.02,27.66 17.02,29.21 16.38,29.84 C32.1
N$17
  cutout $GND: 15.61,47.18 arc-90 16.3,47.87 16.31,47.87 arc-91 16.99,47.18 arc-88 16.3,46.49 arc-92
N$18
  cutout $+3V3: 11.71,47.18 arc-90 12.4,47.87 12.41,47.87 arc-91 13.09,47.18 arc-88 12.4,46.49 arc-92
N$19
  cutout $+3V3: 15.61,47.18 arc-90 16.3,47.87 16.31,47.87 arc-91 16.99,47.18 arc-88 16.3,46.49 arc-92
N$20
  cutout Bottom: 11.71,47.18 arc-90 12.4,47.87 12.41,47.87 arc-91 13.09,47.18 arc-88 12.4,46.49 arc-92
N$21
  cutout Bottom: 15.61,47.18 arc-90 16.3,47.87 16.31,47.87 arc-91 16.99,47.18 arc-88 16.3,46.49 arc-92
N$22
  cutout $+3V3: 10.96,48.7 10.96,49.86 arc-90 11.62,50.39 11.63,50.39 arc-90 12.19,49.83 12.19,48.74 arc-90 11.66,48.16 arc-90
  cutout $+3V3: 16.51,48.7 16.51,49.83 arc-90 17.07,50.39 17.08,50.39 arc-90 17.74,49.81 17.74,48.74 arc-90 17.01,48.16 arc-90
N$27
  Top 0.203: LED2.BLUE 10.01,35.23 R11.1
N$29
  Top 0.203: R9.1 10.01,32.49 10.75,33.23 LED2.GREEN
N$54
  Top 0.203: LED2.RED 9.23,33.23 8.23,32.23 R12.1
OSC32_IN_UC
  Bottom 0.203: Y1.X1 10.14,16.24 10.39,16.48 C34.1 10.39,17.42 10.16,17.65 8.13,17.65 7.59,18.19 7.59,18.95 U3.3
OSC32_OUT_UC
  Bottom 0.203: Y1.X2 7.64,16.24 7.39,16.48 C33.1 7.49,17.12 7.49,17.78 7.24,18.03 7.24,19.3 U3.4
OSC_IN_UC
  Bottom 0.203: Y2.1 5.71,16.13 6.07,16.48 C28.1 6.17,17.12 6.17,18.11 6.86,18.8 6.86,19.62 U3.5
OSC_OUT_UC
  Bottom 0.203: Y2.3 3.43,12.95 4.32,13.84 4.32,16.13 4.06,16.38 3.3,16.38 3.07,16.61 C26.1 3.07,17.42 3.56,17.91 4.7,17.91 5.33,18.54 6.1,18.54 6.48,18.92 6.48,19.95 U3.6
P_3V3  (via drill 0.3)
  Top 0.254: v11.18,36.02 10.87,36.02 10.44,36.45 10.44,37.95 10.57,38.08 11.1,38.08 U9.1
  $+3V3 0.406: v14.73,35.81 11.38,35.81 v11.18,36.02
  Bottom 0.203: U2.3 16.51,35.61 C19.1 | U2.3 U2.4 15.33,35.21 U2.5 | C18.1 12.83,35.61 U8.3 11.48,35.61 11.18,35.92 v11.18,36.02 | U2.3 14.93,35.61 v14.73,35.81
PA8_PM_SCL  (via drill 0.3)
  Top 0.203: U4.7 14.61,43.94 14.43,44.12 13.77,44.12 13.59,43.94 13.59,43.46 13.06,42.93 v13.03,42.93
  $+3V3 0.203: v13.03,42.93 14.1,41.86 14.1,39.7 14.38,39.42 15.04,39.42 15.52,38.94 15.52,37.47 15.67,37.31 15.67,33.3 v15.24,32.87
  Bottom 0.203: U3.41 14.99,29.87 14.99,32.03 15.24,32.28 v15.24,32.87 | v13.03,42.93 14.1,42.93 arc90 U$9.P$1 14.35,43.18 14.58,43.41 R14.1
  Bottom 0.254: v13.03,42.93 12.95,42.93 12.69,43.19 U$1.5
PC9_PM_SDA  (via drill 0.3)
  Top 0.203: U4.8 14.07,43.44 13.61,42.98 13.61,42.67 13.11,42.16 v12.75,42.16
  $+3V3 0.203: v12.75,42.16 13.21,42.16 13.69,41.68 13.69,39.32 13.51,39.14 13.51,38.73 13.26,38.48 13.26,37.92 13.69,37.49 14.96,37.49 15.32,37.13 15.32,33.73 14.58,32.99 14.58,32.44 14.99,32.03 14.99,29.84 13.08,27.94 v12.24,27.94
  Bottom 0.203: U3.40 12.35,27.94 v12.24,27.94 | v12.75,42.16 13.59,42.16 R13.1 | R13.1 14.17,41.63 | R13.1 14.17,41.58 U$8.P$1
  Bottom 0.254: U$1.6 12.13,42.35 12.32,42.16 v12.75,42.16
PMID
  Bottom 0.254: U$1.23 10.91,46.88 10.29,47.5 C5.1
  pour Bottom (no thermals): 11.18,45.47 10.67,45.47 10.69,46.51 9.8,46.51 9.78,48.51 11.43,48.51 11.68,48.26 11.68,46.86 11.18,46.35
PWR_UB  (via drill 0.3)
  Top 0.203: U1.15 16.81,21.97 15.62,21.97 15.24,21.59 12.57,21.59 12.32,21.84 11.56,21.84 11.05,22.35 10.54,22.35 9.65,21.46 v9.65,20.83
  $GND 0.203: v9.2,37.39 9.27,37.31 9.27,35.1 9.55,34.82 9.55,32.94 9.14,32.54 9.14,30.23 9.53,29.84 9.53,20.95 v9.65,20.83
  Bottom 0.203: U5.4 5.21,36.8 5.21,37.77 5.38,37.95 6.5,37.95 6.76,37.69 R1.1 arc90 6.83,37.39 v9.2,37.39
PWR_UC
  Bottom 0.203: U3.28 6.71,31.33 6.71,31.98 6.48,32.21 6.48,32.92 6.1,33.3 U5.2 6.1,35.18 5.89,35.38 3.05,35.38 2.72,35.71 2.72,38.25 3.02,38.56 R29.1
REGN  (via drill 0.3)
  $+3V3 0.254: v8.51,47.24 8.26,46.86 8.26,42.67 9.32,41.6 9.32,38.48 v9.09,38.25
  Bottom 0.203: R18.1 7.87,39.57 8.15,39.29 8.53,39.29 8.87,38.96 8.87,38.48 v9.09,38.25
  Bottom 0.254: C25.1 8.51,47.77 v8.51,47.24 8.76,46.99 9.88,46.99 10.41,46.46 U$1.22 | 7.87,39.7 R18.1
RESET_UB  (via drill 0.3)
  Top 0.203: 17.03,24.89 U1.18 arc-90 16.98,24.84 13.36,24.84 12.95,24.43 12.95,23.88 12.19,23.11 10.79,23.11 8.89,21.21 v8.89,20.7
  $GND 0.203: v8.89,20.7 8.89,20.83 9.14,21.08 9.14,29.72 8.76,30.1 8.76,32.84 9.14,33.22 9.14,34.62 8.69,35.08 v8.69,36.73
  Bottom 0.203: U6.4 3.16,35.96 3.38,35.74 6.96,35.74 7.42,36.2 7.62,36.2 8.15,36.73 v8.69,36.73
RESET_UC
  Bottom 0.203: U3.24 5.46,29.75 5.46,32.03 4.22,33.27 R30.1 3.81,33.78 U6.2
RGB_BLUE  (via drill 0.3)
  Top 0.203: R11.2 8.28,35.18 6.73,35.18 6.12,34.57 6.12,32.79 v5.84,32.51
  $+3V3 0.203: v5.97,26.16 6.1,26.16 6.6,26.67 6.6,30.33 5.54,31.39 5.54,32.21 v5.84,32.51
  Bottom 0.152: U3.17 2.79,26.17 U$13.P$1
  Bottom 0.203: U3.17 4.09,26.16 v5.97,26.16
RGB_GREEN  (via drill 0.3)
  Top 0.203: R9.2 9.04,31.52 8.51,30.99 5.49,30.99 5.21,31.27 5.21,33.02 v5.33,33.15
  $+3V3 0.203: v6.73,24.51 6.73,25.53 7.37,26.16 7.37,31.88 6.1,33.15 v5.33,33.15
  Bottom 0.152: U3.16 2.79,23.34 2.79,22.94 U$12.P$1
  Bottom 0.203: U3.16 4.6,25.15 6.22,25.15 6.73,24.64 v6.73,24.51
RGB_RED  (via drill 0.3)
  Top 0.203: R12.2 7.19,31.7 v6.12,31.7
  $+3V3 0.203: v5.97,24.51 5.97,25.27 6.99,26.29 6.99,30.99 6.27,31.7 v6.12,31.7
  Bottom 0.152: U3.15 3.38,23.21 3.38,21.69 3.23,21.69 U$11.P$1
  Bottom 0.203: U3.15 4.67,24.51 v5.97,24.51
RI_UB  (via drill 0.3)
  Top 0.203: v10.79,21.72 10.67,21.59 10.67,20.83 11.56,19.94 12.7,19.94 13.59,19.05 13.59,17.91 13.97,17.53 13.97,13.84 15.24,12.57 16.81,12.57 U1.7
  $GND 0.203: v10.79,21.72 10.62,21.89 10.62,24.21 11.18,24.77 11.18,28.57 12.57,29.97 12.57,32.87 13.46,33.76 13.46,35.18 10.87,37.77 v10.87,39.04
  Bottom 0.203: U8.14 10.97,38.94 v10.87,39.04 11.05,39.04 11.43,39.42 R28.1
RI_UC
  Bottom 0.203: 11.57,32.32 U3.33 11.57,32.67 10.97,33.27 10.97,34.27 10.98,34.27 U8.7
RTS_UB  (via drill 0.3)
  Top 0.203: v14.61,16.64 14.99,16.26 17.03,16.26 U1.10
  $GND 0.203: v14.61,16.64 14.61,16.89 15.24,17.53 15.24,20.57 14.86,20.95 14.86,21.72 16.26,23.11 16.26,36.73 v14.94,38.05
  Bottom 0.203: U2.15 v14.93,38.05 v14.94,38.05
RTS_UC
  Bottom 0.203: 12.36,31.41 U3.35 12.28,31.46 13.01,32.18 13.01,32.72 13.77,33.48 14.53,33.48 14.93,33.88 | 15.98,33.76 R24.1 arc90 16.06,33.88 14.93,33.88 | U2.6 14.93,33.88
RX  (via drill 0.3)
  $+3V3 0.203: JP1.4 2.54,38.1 2.54,36.07 2.92,35.69 2.92,33.66 3.68,32.89 3.68,31.62 4.7,30.61 4.7,27.69 5.46,26.92 v5.97,26.92
  Bottom 0.203: U3.43 14.34,27.81 13.69,27.81 12.9,27.03 11.99,27.03 11.68,26.72 11.68,25.88 10.54,24.74 8.66,24.74 6.48,26.92 v5.97,26.92
RXD_UB  (via drill 0.3)
  Top 0.203: U1.13 16.94,19.3 14.35,19.3 12.45,21.21 v12.06,21.21
  $GND 0.203: v12.06,21.21 12.06,20.95 11.56,20.45 11.05,20.45 10.24,21.26 10.24,24.41 10.79,24.97 10.79,28.7 12.19,30.1 12.19,32.61 11.28,33.53 11.28,35.15 11.84,35.71 11.84,36.27 9.91,38.2 v9.91,38.25
  Bottom 0.203: U8.13 10.58,37.35 9.91,38.02 v9.91,38.25 9.91,38.33 9.53,38.71 9.53,38.86 8.97,39.42 8.97,39.57 R21.1
RXD_UC
  Bottom 0.203: U3.30 8.59,30.86 8.89,30.86 9.93,31.9 9.93,32.59 10.58,33.23 U8.8
SIM_CLK  (via drill 0.3)
  Top 0.203: U1.38 5.17,22.77 7.75,20.19 7.75,14.86 11.43,11.18 11.43,10.54 10.92,10.03 v10.03,10.03
  Top 0.406: v15.62,1.02 15.24,1.4 C12.1
  Bottom 0.305: v10.03,10.03 10.03,7.75 13.34,4.45 13.34,1.78 13.84,1.27 14.19,1.27 J1.C3 14.44,1.02
  Bottom 0.406: J1.C3 15.59,0.98 v15.62,1.02
SIM_IO  (via drill 0.3)
  Top 0.203: U1.39 5.76,21.67 7.37,20.07 7.37,14.73 10.67,11.43 v10.67,11.05
  Bottom 0.254: 14.45,13.11 15.54,14.2 C13.1
  Bottom 0.305: v10.67,11.05 10.67,10.29 11.18,9.78 12.7,9.78 13.21,10.29 13.21,12.19 13.59,12.57 14.47,12.57 J1.C7 | 14.45,12.61 14.45,13.11
  Bottom 0.406: 14.45,12.61 J1.C7
SIM_RST  (via drill 0.3)
  Top 0.203: U1.40 3.68,20.57 4.32,21.21 5.71,21.21 6.99,19.94 6.99,14.61 8.76,12.83 v8.76,10.03
  Top 0.406: v13.08,1.02 13.21,1.14 C10.1
  Bottom 0.305: v8.76,10.03 8.76,6.48 10.67,4.57 10.67,1.91 11.3,1.27 11.65,1.27 J1.C2 11.9,1.02
  Bottom 0.406: J1.C2 13.05,0.98 v13.08,1.02
SIM_VCC  (via drill 0.3)
  Top 0.406: C11.1 10.67,2.06 | 10.67,2.06 C14.1 | U1.41 3.38,19.3 5.33,19.3 6.35,18.29 6.35,10.54 6.86,10.03 v7.49,10.03 | v10.54,1.02 10.67,1.14 10.67,2.06
  Bottom 0.406: v10.54,1.02 10.51,0.98 J1.C1 9.36,1.02 9.27,1.02 8.53,1.75 8.53,4.29 7.49,5.33 v7.49,10.03 8.26,10.79 8.26,13.21 8.71,13.66 10.64,13.66 11.73,12.58 J1.C6
STAT  (via drill 0.3)
  Top 0.305: R4.1 9.91,39.27 v10.08,39.09
  $+3V3 0.254: v13.03,43.69 12.95,43.69 12.06,42.8 12.06,41.07 v10.08,39.09
  Bottom 0.254: U$1.4 v13.03,43.69
SW1
  pour Bottom (rank 2, no thermals): 9.42,45.57 7.44,45.57 7.06,45.69 7.06,47.17 6.91,47.57 6.12,48.23 3.12,48.23 2.92,48.44 2.92,49.91 3.12,50.11 7.19,50.11 8,49.3 8,46.69 8.41,46.28 9.42,46.28
SW2
  pour Top (rank 3, no thermals): 3.05,40.64 3.3,40.64 3.3,40.01 3.94,39.37 4.45,39.37 4.7,39.12 4.7,36.45 4.45,36.2 3.43,36.2 3.05,36.58
TS
  Bottom 0.203: 7.87,40.72 R18.2 | U$1.12 U$1.11 | R19.1 R18.2 | 8.91,41.78 U$1.12 | R18.2 7.87,41.25 7.98,41.35 8.56,41.35 8.91,41.7 U$1.12
TX  (via drill 0.3)
  $+3V3 0.203: v5.97,27.69 5.71,27.69 5.08,28.32 5.08,30.73 4.06,31.75 4.06,33.02 3.3,33.78 3.3,35.81 2.92,36.2 2.92,38.23 2.54,38.61 2.54,39.88 1.27,41.15 JP1.3
  Bottom 0.203: U3.42 14.12,28.3 13.49,28.3 12.57,27.38 11.79,27.38 11.33,26.92 11.33,26.04 10.39,25.09 8.81,25.09 6.22,27.69 v5.97,27.69
TXD_UB  (via drill 0.3)
  Top 0.203: U1.12 14.89,18.37 v14.66,18.14
  $GND 0.203: v14.86,38.81 14.38,38.33 14.38,37.74 15.88,36.25 15.88,23.24 14.48,21.84 14.48,20.83 14.86,20.45 14.86,18.34 v14.66,18.14
  Bottom 0.203: U2.14 14.53,37.64 14.38,37.8 14.38,38.33 v14.86,38.81
TXD_UC  (via drill 0.3)
  $+3V3 0.203: v11.89,33.78 10.72,32.61 v10.72,32.28
  Bottom 0.203: U2.7 14.53,34.22 14.53,34.21 14.53,33.98 14.38,33.83 13.61,33.83 12.98,33.2 12.32,33.2 11.89,33.63 v11.89,33.78 11.89,33.73 | v10.72,32.28 10.72,32.18 9.02,30.48 8.26,30.48 U3.29 7.68,31.06
  Bottom 0.305: 7.68,31.06 7.11,31.62 R25.1
USB_DM
  Top 0.406: X1.D- 15,45.2 U$7.P$2
  Bottom 0.203: U$1.3 12.75,44.19 12.8,44.25 13.34,44.25 13.56,44.02 14.3,44.02 U$7.P$2 15.75,44.96 17.14,43.56 17.14,42.01 R6.2
USB_DM_UC
  Bottom 0.203: U3.44 16,28.77 16,28.96 15.37,29.59 15.37,31.88 15.62,32.13 16.76,32.13 17.14,32.51 17.14,38.89 16.61,39.42 16.28,39.42 16,39.7 R6.1
USB_DP
  Top 0.406: X1.D+ 14.35,45.34 U$7.P$1
  Bottom 0.203: U$1.2 13.7,44.69 U$7.P$1 14.86,45.85 15.62,45.85 17.53,43.94 17.53,41.45 R5.2
USB_DP_UC
  Bottom 0.203: U3.45 16.51,28.57 16.51,29.08 15.75,29.84 15.75,31.62 15.88,31.75 17.02,31.75 17.53,32.26 17.53,39.32 R5.1
V_BCKP  (via drill 0.3)
  Top 0.203: U1.2 16.63,7.37 16.13,7.87 12.57,7.87 12.19,8.26 12.19,10.92 v12.17,10.95
  $GND 0.203: v8.28,37.97 8.1,37.8 8.1,35.03 7.75,34.67 7.75,33.27 8.38,32.64 8.38,29.97 8.76,29.59 8.76,21.46 8.26,20.95 8.26,14.86 v12.17,10.95
  Bottom 0.203: R1.2 7.82,38.43 v8.28,37.97
V_INT  (via drill 0.3)
  Top 0.203: U1.4 17.03,9.65 14.73,9.65 13.59,10.79 13.59,17.02 v13.41,17.2
  $GND 0.203: v14.1,38.91 14.55,39.37 15.11,39.37 15.44,39.04 15.44,38.63 16.03,38.05 v16.08,38.05 16.08,37.74 16.64,37.19 16.64,22.99 15.24,21.59 15.24,21.08 15.62,20.7 15.62,16.76 14.86,16 13.97,16 13.41,16.56 v13.41,17.2
  Bottom 0.152: U8.2 12.49,36.01 C21.1
  Bottom 0.178: C21.1 12.78,36.35
  Bottom 0.203: C22.1 16.41,36.35 | 16.41,36.35 16.07,36.01 U2.2 | 16.41,36.35 15.88,36.88 15.88,37.85 v16.08,38.05 | C21.1 12.85,36.35 13.46,36.96 13.46,37.74 13.26,37.95 13.26,38.48 13.69,38.91 v14.1,38.91 | R3.2 15.47,17.2 v13.41,17.2
VBAT  (via drill 0.3)
  $GND 0.203: JP2.16 17.78,40.64 17.78,21.34 16.76,20.32 16.76,14.86 15.72,13.82 15.09,13.82 13.44,12.17 11.51,12.17 10.11,13.56 10.11,17.32 v9.17,18.26
  $GND 0.254: v9.17,18.26 10.69,18.26 12.8,16.15 12.8,15.7 v12.88,15.62
  Bottom 0.203: U3.1 9.04,18.39 v9.17,18.26
  Bottom 0.305: J3.2 v12.88,15.62
VBUS  (via drill 0.3)
  Top 0.61: v17.02,45.97 17.17,46.13
  other vias: 16.38,45.97
  pour Top (rank 2, no thermals): 15.62,45.85 15.62,48.13 17.14,48.13 17.14,50.29 19.94,50.29 19.94,47.75 18.16,47.75 18.16,45.59 15.88,45.59
  pour Bottom (rank 2, no thermals): 14.48,46.86 17.27,46.86 17.53,46.61 17.53,45.85 17.27,45.59 16.38,45.59 15.75,46.23 14.48,46.23
VIN  (via drill 0.3)
  $+3V3 1.016: JP1.1 3.05,48.77 9.17,48.77 9.17,48.74 9.91,48.01 9.91,46.74 10.67,45.97 12.09,45.97 v12.29,45.74
  other vias: 12.01,46.1
  pour Bottom (rank 3, no thermals): 11.3,45.47 11.3,46.23 11.68,46.61 11.94,46.86 11.94,47.75 12.45,47.75 12.57,47.75 12.57,48.39 13.34,48.39 15.75,48.39 16.13,48.39 16.13,46.23 14.35,46.23 14.1,46.23 12.95,45.09 11.68,45.09 11.68,45.47
WKP  (via drill 0.3)
  $+3V3 0.203: JP1.5 2.54,35.56 2.54,33.53 3.3,32.77 3.3,31.5 4.32,30.48 4.32,27.56 5.33,26.54 5.33,24.21 5.79,23.75 v6.35,23.75
  Bottom 0.203: v6.35,23.75 6.15,23.95 4.82,23.95 U3.14
(copper drawn outside any net)
  shapes: Bottom area x1

## Text on the board
tPlace: LI+ | VUSB | VIN | 3V3 | D+ | D- | GND | RST | + | TX | VBAT | RX | GND | D7 | WKP | DAC | D6 | MODE | RESET | A5 | D5 | A4 | D4 | A3 | D3 | A2 | D2 | A1 | D1 | A0 | D0 | B5 | C5 | B4 | C4 | B3 | C3 | B2 | C2 | B1 | C1 | B0 | C0
bPlace: PMID | SCL | SDA | MODE | v020
tDocu: NOTES: / / Layer stack up: / 1 - GTL - Top Signal, GND / 2 - G2L - Inner Signal, GND, +3V8 / 15 - G15L - Inner Signal, GND, +3V3 / 16 - GBL - Bottom Signal, GND | Reference Designs ARE PROVIDED "AS IS" AND "WITH ALL FAULTS. PARTICLE INDUSTRIES, INC / ("PARTICLE") DISCLAIMS ALL OTHER WARRANTIES, EXPRESS OR IMPLIED, REGARDING / PRODUCTS OR THE REFERENCE DESIGNS, INCLUDING BUT NOT LIMITED TO, ANY / IMPLIED WARRANTIES OF MERCHANTABILITY, FITNESS FOR A PARTICULAR PURPOSE, / OR NON-INFRINGEMENT. / / Particle may make changes to specifications and product descriptions at any / time, without notice. The Customer must not rely on the absence or / characteristics of any features or instructions marked "reserved" or / "undefined." Particle reserves these for future definition and shall have / no responsibility whatsoever for conflicts or incompatibilities arising / from future changes to them. The product information on the Web Site or / Materials is subject to change without notice. Do not finalize a design / with this information. / Particle is a registered trademark.
bDocu: PMID | BLUE | GREEN | RED | VBAT-3V3 / JUMPER | MODE BTN TEST POINT